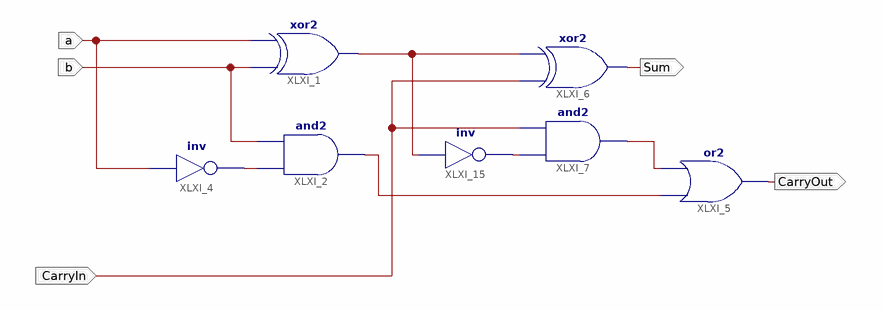
[diagram p0: schematic sheet 1]
// Xilinx ISE schematic fullSubtractor.sch (spartan6) as structural Verilog: 7 symbols, 5 ports
module fullSubtractor (
  input  a,
  input  b,
  input  CarryIn,
  output Sum,
  output CarryOut
);

  wire XLXN_8, XLXN_17, XLXN_19, XLXN_22, XLXN_37;

  xor XLXI_1 (XLXN_17, b, a);
  and XLXI_2 (XLXN_37, XLXN_8, b);
  not XLXI_4 (XLXN_8, a);
  xor XLXI_6 (Sum, CarryIn, XLXN_17);
  or XLXI_5 (CarryOut, XLXN_37, XLXN_19);
  and XLXI_7 (XLXN_19, XLXN_22, CarryIn);
  not XLXI_15 (XLXN_22, XLXN_17);
endmodule
